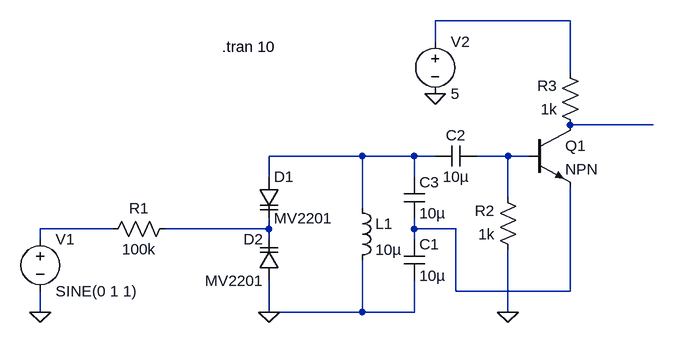
[diagram p0: schematic vco_attempt.asc]
vco_attempt.asc, the LTspice schematic file:
Version 4
SHEET 1 1032 680
WIRE 784 -64 576 -64
WIRE 576 -32 576 -64
WIRE 784 16 784 -64
WIRE 912 96 784 96
WIRE 464 144 320 144
WIRE 544 144 464 144
WIRE 576 144 544 144
WIRE 688 144 640 144
WIRE 720 144 688 144
WIRE 320 176 320 144
WIRE 544 176 544 144
WIRE 688 208 688 144
WIRE 464 224 464 144
WIRE 80 256 -32 256
WIRE 320 256 320 240
WIRE 320 256 160 256
WIRE 544 256 544 240
WIRE 608 256 544 256
WIRE -32 272 -32 256
WIRE 320 272 320 256
WIRE 544 272 544 256
WIRE 608 352 608 256
WIRE 784 352 784 192
WIRE 784 352 608 352
WIRE -32 384 -32 352
WIRE 320 384 320 336
WIRE 464 384 464 304
WIRE 464 384 320 384
WIRE 544 384 544 336
WIRE 544 384 464 384
WIRE 688 384 688 288
FLAG 576 48 0
FLAG 688 384 0
FLAG -32 384 0
FLAG 320 384 0
SYMBOL varactor 304 176 R0
SYMATTR InstName D1
SYMATTR Value MV2201
SYMBOL varactor 336 336 R180
WINDOW 0 24 64 Left 2
WINDOW 3 24 0 Left 2
SYMATTR InstName D2
SYMATTR Value MV2201
SYMBOL res 176 240 R90
WINDOW 0 0 56 VBottom 2
WINDOW 3 32 56 VTop 2
SYMATTR InstName R1
SYMATTR Value 100k
SYMBOL voltage -32 256 R0
SYMATTR InstName V1
SYMATTR Value SINE(0 1 1)
SYMBOL ind 448 208 R0
SYMATTR InstName L1
SYMATTR Value 10µ
SYMBOL cap 528 272 R0
SYMATTR InstName C1
SYMATTR Value 10µ
SYMBOL npn 720 96 R0
SYMATTR InstName Q1
SYMBOL cap 640 128 R90
WINDOW 0 0 32 VBottom 2
WINDOW 3 32 32 VTop 2
SYMATTR InstName C2
SYMATTR Value 10µ
SYMBOL res 704 304 R180
WINDOW 0 36 76 Left 2
WINDOW 3 36 40 Left 2
SYMATTR InstName R2
SYMATTR Value 1k
SYMBOL cap 528 176 R0
SYMATTR InstName C3
SYMATTR Value 10µ
SYMBOL res 800 112 R180
WINDOW 0 36 76 Left 2
WINDOW 3 36 40 Left 2
SYMATTR InstName R3
SYMATTR Value 1k
SYMBOL voltage 576 -48 R0
SYMATTR InstName V2
SYMATTR Value 5
TEXT 248 -24 Left 2 !.tran 10

The netlist it stands for:
* vco_attempt.asc
D1 N003 N006 MV2201
D2 0 N006 MV2201
R1 N006 N005 100k
V1 N005 0 SINE(0 1 1)
L1 N003 0 10µ
C1 N007 0 10µ
Q1 N002 N004 N007 0 NPN
C2 N004 N003 10µ
R2 0 N004 1k
C3 N003 N007 10µ
R3 N002 N001 1k
V2 N001 0 5
.model D D
.lib standard.dio
.model NPN NPN
.model PNP PNP
.lib standard.bjt
.tran 10
.backanno
.end